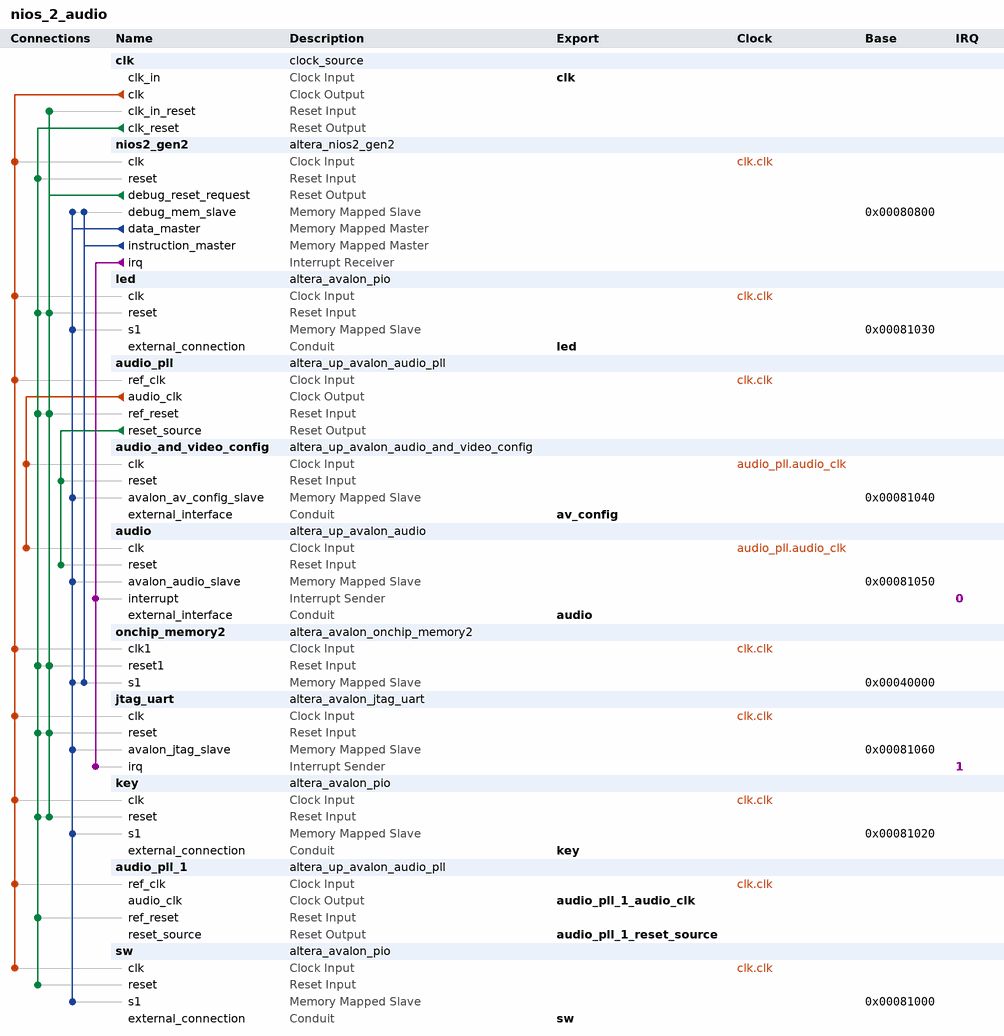
[diagram p0: system contents]
# Platform Designer (Qsys) system nios_2_audio, Cyclone V 5CSEMA5F31C6
# Parameters at their usual value, and those the tool derives, are not listed.
package require -exact qsys 18.1
create_system nios_2_audio
set_project_property DEVICE_FAMILY {Cyclone V}
set_project_property DEVICE 5CSEMA5F31C6

add_instance clk clock_source 18.1
set_instance_parameter_value clk clockFrequency 50000000

add_instance nios2_gen2 altera_nios2_gen2 18.1
set_instance_parameter_value nios2_gen2 dcache_size 2048
set_instance_parameter_value nios2_gen2 exceptionSlave onchip_memory2.s1
set_instance_parameter_value nios2_gen2 icache_size 4096
set_instance_parameter_value nios2_gen2 impl Fast
set_instance_parameter_value nios2_gen2 resetSlave onchip_memory2.s1

add_instance led altera_avalon_pio 18.1
set_instance_parameter_value led direction Output
set_instance_parameter_value led width 10

add_instance audio_pll altera_up_avalon_audio_pll 18.0
set_instance_parameter_value audio_pll gui_refclk 50.0

add_instance audio_and_video_config altera_up_avalon_audio_and_video_config 18.0
set_instance_parameter_value audio_and_video_config audio_in {Line In to ADC}
set_instance_parameter_value audio_and_video_config bit_length 16
set_instance_parameter_value audio_and_video_config board DE1-SoC
set_instance_parameter_value audio_and_video_config line_in_bypass false
set_instance_parameter_value audio_and_video_config sampling_rate {48 kHz}

add_instance audio altera_up_avalon_audio 18.0
set_instance_parameter_value audio audio_in true
set_instance_parameter_value audio avalon_bus_type {Memory Mapped}
set_instance_parameter_value audio dw 16

add_instance onchip_memory2 altera_avalon_onchip_memory2 18.1
set_instance_parameter_value onchip_memory2 dataWidth 32
set_instance_parameter_value onchip_memory2 dualPort false
set_instance_parameter_value onchip_memory2 initMemContent true
set_instance_parameter_value onchip_memory2 initializationFileName onchip_mem.hex
set_instance_parameter_value onchip_memory2 memorySize 189752

add_instance jtag_uart altera_avalon_jtag_uart 18.1
set_instance_parameter_value jtag_uart simInteractiveOptions NO_INTERACTIVE_WINDOWS

add_instance key altera_avalon_pio 18.1
set_instance_parameter_value key bitClearingEdgeCapReg true
set_instance_parameter_value key captureEdge true
set_instance_parameter_value key direction Input
set_instance_parameter_value key irqType EDGE
set_instance_parameter_value key width 4

add_instance audio_pll_1 altera_up_avalon_audio_pll 18.0
set_instance_parameter_value audio_pll_1 gui_refclk 50.0

add_instance sw altera_avalon_pio 18.1
set_instance_parameter_value sw bitModifyingOutReg true
set_instance_parameter_value sw direction Input
set_instance_parameter_value sw width 10

# connections
add_connection audio_pll.audio_clk audio.clk clock
add_connection audio_pll.audio_clk audio_and_video_config.clk clock
add_connection clk.clk audio_pll.ref_clk clock
add_connection clk.clk audio_pll_1.ref_clk clock
add_connection clk.clk jtag_uart.clk clock
add_connection clk.clk key.clk clock
add_connection clk.clk led.clk clock
add_connection clk.clk nios2_gen2.clk clock
add_connection clk.clk onchip_memory2.clk1 clock
add_connection clk.clk sw.clk clock
add_connection audio_pll.reset_source audio.reset reset
add_connection audio_pll.reset_source audio_and_video_config.reset reset
add_connection clk.clk_reset audio_pll.ref_reset reset
add_connection clk.clk_reset audio_pll_1.ref_reset reset
add_connection clk.clk_reset jtag_uart.reset reset
add_connection clk.clk_reset key.reset reset
add_connection clk.clk_reset led.reset reset
add_connection clk.clk_reset nios2_gen2.reset reset
add_connection clk.clk_reset onchip_memory2.reset1 reset
add_connection clk.clk_reset sw.reset reset
add_connection nios2_gen2.debug_reset_request audio_pll.ref_reset reset
add_connection nios2_gen2.debug_reset_request clk.clk_in_reset reset
add_connection nios2_gen2.debug_reset_request jtag_uart.reset reset
add_connection nios2_gen2.debug_reset_request key.reset reset
add_connection nios2_gen2.debug_reset_request led.reset reset
add_connection nios2_gen2.debug_reset_request onchip_memory2.reset1 reset
add_connection nios2_gen2.data_master audio.avalon_audio_slave avalon
set_connection_parameter_value nios2_gen2.data_master/audio.avalon_audio_slave baseAddress 0x00081050
add_connection nios2_gen2.data_master audio_and_video_config.avalon_av_config_slave avalon
set_connection_parameter_value nios2_gen2.data_master/audio_and_video_config.avalon_av_config_slave baseAddress 0x00081040
add_connection nios2_gen2.data_master jtag_uart.avalon_jtag_slave avalon
set_connection_parameter_value nios2_gen2.data_master/jtag_uart.avalon_jtag_slave baseAddress 0x00081060
add_connection nios2_gen2.data_master key.s1 avalon
set_connection_parameter_value nios2_gen2.data_master/key.s1 baseAddress 0x00081020
add_connection nios2_gen2.data_master led.s1 avalon
set_connection_parameter_value nios2_gen2.data_master/led.s1 baseAddress 0x00081030
add_connection nios2_gen2.data_master nios2_gen2.debug_mem_slave avalon
set_connection_parameter_value nios2_gen2.data_master/nios2_gen2.debug_mem_slave baseAddress 0x00080800
add_connection nios2_gen2.data_master onchip_memory2.s1 avalon
set_connection_parameter_value nios2_gen2.data_master/onchip_memory2.s1 baseAddress 0x00040000
add_connection nios2_gen2.data_master sw.s1 avalon
set_connection_parameter_value nios2_gen2.data_master/sw.s1 baseAddress 0x00081000
add_connection nios2_gen2.instruction_master nios2_gen2.debug_mem_slave avalon
set_connection_parameter_value nios2_gen2.instruction_master/nios2_gen2.debug_mem_slave baseAddress 0x00080800
add_connection nios2_gen2.instruction_master onchip_memory2.s1 avalon
set_connection_parameter_value nios2_gen2.instruction_master/onchip_memory2.s1 baseAddress 0x00040000
add_connection nios2_gen2.irq audio.interrupt interrupt
set_connection_parameter_value nios2_gen2.irq/audio.interrupt irqNumber 0
add_connection nios2_gen2.irq jtag_uart.irq interrupt
set_connection_parameter_value nios2_gen2.irq/jtag_uart.irq irqNumber 1

# exported interfaces
add_interface audio conduit end
set_interface_property audio EXPORT_OF audio.external_interface
add_interface audio_pll_1_audio_clk clock source
set_interface_property audio_pll_1_audio_clk EXPORT_OF audio_pll_1.audio_clk
add_interface audio_pll_1_reset_source reset source
set_interface_property audio_pll_1_reset_source EXPORT_OF audio_pll_1.reset_source
add_interface av_config conduit end
set_interface_property av_config EXPORT_OF audio_and_video_config.external_interface
add_interface clk clock sink
set_interface_property clk EXPORT_OF clk.clk_in
add_interface key conduit end
set_interface_property key EXPORT_OF key.external_connection
add_interface led conduit end
set_interface_property led EXPORT_OF led.external_connection
add_interface sw conduit end
set_interface_property sw EXPORT_OF sw.external_connection

set_interconnect_requirement {$system} qsys_mm.clockCrossingAdapter HANDSHAKE
set_interconnect_requirement {$system} qsys_mm.enableEccProtection FALSE
set_interconnect_requirement {$system} qsys_mm.insertDefaultSlave FALSE
set_interconnect_requirement {$system} qsys_mm.maxAdditionalLatency 1

save_system nios_2_audio.qsys
